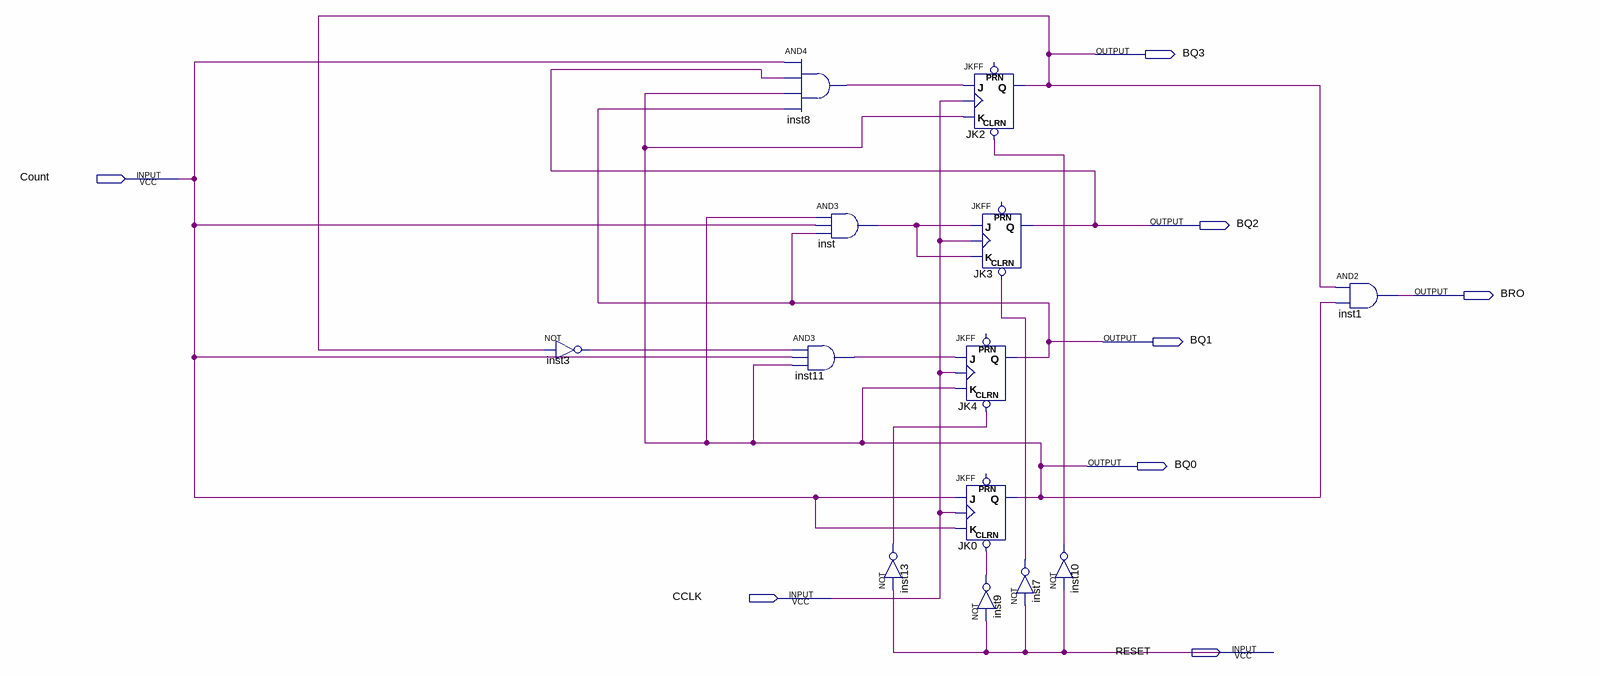
[diagram p0: schematic sheet]
// Quartus schematic lab2PartBtest2.bdf as structural Verilog: 13 symbols, 8 pins
module lab2PartBtest2 (
  input  Count,
  input  CCLK,
  input  RESET,
  output BQ3,
  output BQ2,
  output BRO,
  output BQ1,
  output BQ0
);

  wire inst3_out, inst7_out, inst8_out, inst9_out, inst10_out, inst11_out, inst13_out, inst_out;

  not inst3 (inst3_out, BQ3);
  and inst8 (inst8_out, Count, BQ2, BQ0, BQ1);
  and inst (inst_out, BQ0, Count, BQ1);
  and inst11 (inst11_out, inst3_out, Count, BQ0);
  not inst13 (inst13_out, RESET);
  JKFF JK4 (.CLRN(inst13_out), .K(BQ0), .J(inst11_out), .CLK(CCLK), .Q(BQ1));  // open: PRN
  JKFF JK0 (.CLRN(inst9_out), .K(Count), .J(Count), .CLK(CCLK), .Q(BQ0));  // open: PRN
  JKFF JK2 (.CLRN(inst10_out), .K(BQ0), .J(inst8_out), .CLK(CCLK), .Q(BQ3));  // open: PRN
  JKFF JK3 (.CLRN(inst7_out), .K(inst_out), .J(inst_out), .CLK(CCLK), .Q(BQ2));  // open: PRN
  not inst7 (inst7_out, RESET);
  not inst9 (inst9_out, RESET);
  not inst10 (inst10_out, RESET);
  and inst1 (BRO, BQ3, BQ0);
endmodule
